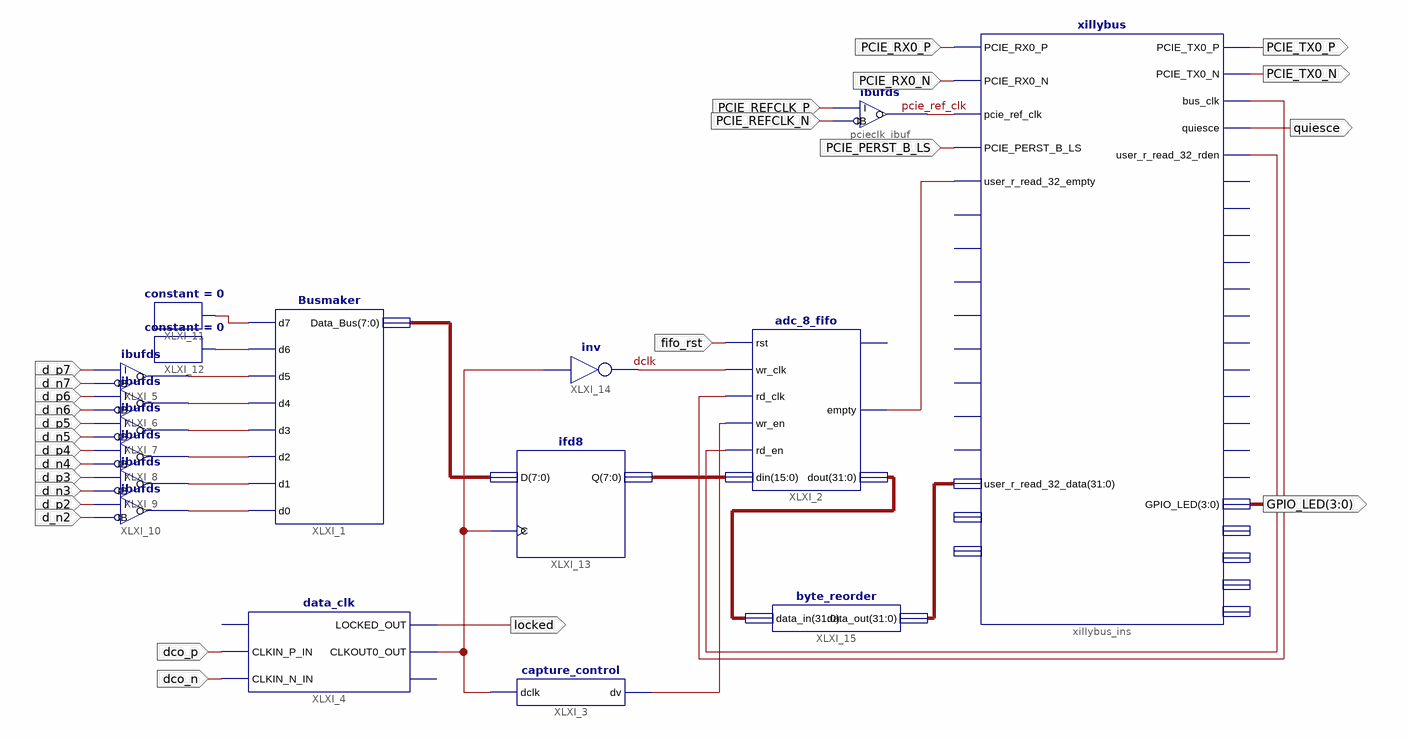
[diagram p0: schematic sheet 1]
// Xilinx ISE schematic sing_chan_cap.sch (virtex5) as structural Verilog: 17 symbols, 25 ports
module sing_chan_cap (
  input  dco_p,
  input  dco_n,
  input  fifo_rst,
  input  PCIE_RX0_P,
  input  PCIE_RX0_N,
  input  PCIE_PERST_B_LS,
  input  PCIE_REFCLK_P,
  input  PCIE_REFCLK_N,
  input  d_p7,
  input  d_n7,
  input  d_p6,
  input  d_n6,
  input  d_p5,
  input  d_n5,
  input  d_p4,
  input  d_n4,
  input  d_p3,
  input  d_n3,
  input  d_p2,
  input  d_n2,
  output PCIE_TX0_P,
  output PCIE_TX0_N,
  output quiesce,
  output [3:0] GPIO_LED,
  output locked
);

  wire dclk, pcie_ref_clk, XLXN_24, XLXN_26, XLXN_32, XLXN_33, XLXN_34, XLXN_61, XLXN_62, XLXN_63, XLXN_64,
       XLXN_65, XLXN_66, XLXN_67, XLXN_68;
  wire [7:0] XLXN_21, XLXN_22;
  wire [31:0] XLXN_69, XLXN_70;

  Busmaker XLXI_1 (
    .d7(XLXN_67), .d6(XLXN_68), .d5(XLXN_61), .d4(XLXN_62), .d3(XLXN_63), .d2(XLXN_64), .d1(XLXN_65),
    .d0(XLXN_66), .Data_Bus(XLXN_21));
  adc_8_fifo XLXI_2 (
    .rst(fifo_rst), .wr_clk(dclk), .rd_clk(XLXN_33), .wr_en(XLXN_24), .rd_en(XLXN_34), .din(XLXN_22),
    .empty(XLXN_32), .dout(XLXN_69));  // open: full
  data_clk XLXI_4 (
    .CLKIN_P_IN(dco_p), .CLKIN_N_IN(dco_n), .LOCKED_OUT(locked), .CLKOUT0_OUT(XLXN_26));  // open: RST_IN, CLKIN_IBUFGDS_OUT
  constant #(.CValue("0")) XLXI_11 (.O(XLXN_67));
  constant #(.CValue("0")) XLXI_12 (.O(XLXN_68));
  ifd8 XLXI_13 (.C(XLXN_26), .D(XLXN_21), .Q(XLXN_22));
  xillybus xillybus_ins (
    .PCIE_RX0_P(PCIE_RX0_P), .PCIE_RX0_N(PCIE_RX0_N), .pcie_ref_clk(pcie_ref_clk),
    .PCIE_PERST_B_LS(PCIE_PERST_B_LS), .user_r_read_32_empty(XLXN_32), .user_r_read_32_data(XLXN_70),
    .PCIE_TX0_P(PCIE_TX0_P), .PCIE_TX0_N(PCIE_TX0_N), .bus_clk(XLXN_33), .quiesce(quiesce),
    .user_r_read_32_rden(XLXN_34), .GPIO_LED(GPIO_LED));  // open: user_r_read_32_eof, user_w_write_32_full, user_r_read_8_empty, user_r_read_8_eof, user_w_write_8_full, user_r_mem_8_empty, user_r_mem_8_eof, user_w_mem_8_full, user_r_read_8_data, user_r_mem_8_data, user_r_read_32_open, user_w_write_32_wren, user_w_write_32_open, user_r_read_8_rden, user_r_read_8_open, user_w_write_8_wren, user_w_write_8_open, user_r_mem_8_rden, user_r_mem_8_open, user_w_mem_8_wren, user_w_mem_8_open, user_mem_8_addr_update, user_w_write_32_data, user_w_write_8_data, user_w_mem_8_data, user_mem_8_addr
  ibufds pcieclk_ibuf (.I(PCIE_REFCLK_P), .IB(PCIE_REFCLK_N), .O(pcie_ref_clk));
  not XLXI_14 (dclk, XLXN_26);
  capture_control XLXI_3 (.dclk(XLXN_26), .dv(XLXN_24));
  ibufds XLXI_5 (.I(d_p7), .IB(d_n7), .O(XLXN_61));
  ibufds XLXI_6 (.I(d_p6), .IB(d_n6), .O(XLXN_62));
  ibufds XLXI_7 (.I(d_p5), .IB(d_n5), .O(XLXN_63));
  ibufds XLXI_8 (.I(d_p4), .IB(d_n4), .O(XLXN_64));
  ibufds XLXI_9 (.I(d_p3), .IB(d_n3), .O(XLXN_65));
  ibufds XLXI_10 (.I(d_p2), .IB(d_n2), .O(XLXN_66));
  byte_reorder XLXI_15 (.data_in(XLXN_69), .data_out(XLXN_70));
endmodule
